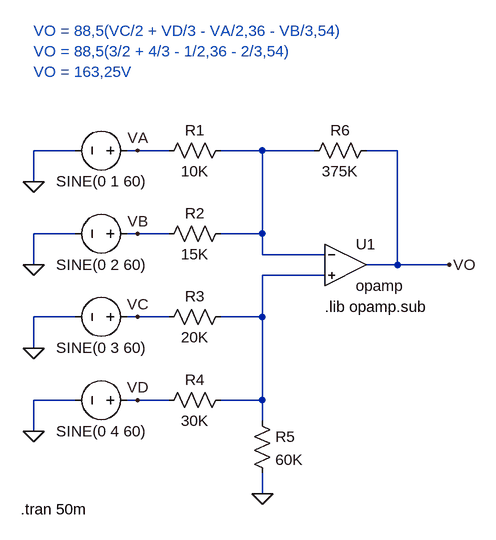
[diagram p0: schematic AMP10 - Amplificadores Ideais - Exercicio III.asc]
AMP10 - Amplificadores Ideais - Exercicio III.asc, the LTspice schematic file:
Version 4
SHEET 1 880 680
WIRE -224 -16 -288 -16
WIRE -128 -16 -144 -16
WIRE -80 -16 -128 -16
WIRE 64 -16 0 -16
WIRE 144 -16 64 -16
WIRE 272 -16 224 -16
WIRE -288 32 -288 -16
WIRE -224 112 -288 112
WIRE -128 112 -144 112
WIRE -80 112 -128 112
WIRE 64 112 64 -16
WIRE 64 112 0 112
WIRE 64 144 64 112
WIRE 160 144 64 144
WIRE -288 160 -288 112
WIRE 272 160 272 -16
WIRE 272 160 224 160
WIRE 352 160 272 160
WIRE 160 176 64 176
WIRE -224 240 -288 240
WIRE -128 240 -144 240
WIRE -80 240 -128 240
WIRE 64 240 64 176
WIRE 64 240 0 240
WIRE -288 288 -288 240
WIRE -224 368 -288 368
WIRE -128 368 -144 368
WIRE -80 368 -128 368
WIRE 64 368 64 240
WIRE 64 368 0 368
WIRE 64 400 64 368
WIRE -288 416 -288 368
WIRE 64 512 64 480
FLAG -288 32 0
FLAG -288 160 0
FLAG -288 288 0
FLAG -288 416 0
FLAG -128 -16 VA
FLAG -128 112 VB
FLAG -128 240 VC
FLAG -128 368 VD
FLAG 64 512 0
FLAG 352 160 VO
SYMBOL Opamps\\opamp 192 96 R0
SYMATTR InstName U1
SYMBOL voltage -128 -16 R90
WINDOW 0 -32 56 Invisible 2
WINDOW 3 32 56 VTop 2
WINDOW 123 0 0 Left 2
WINDOW 39 0 0 Left 2
SYMATTR InstName V1
SYMATTR Value SINE(0 1 60)
SYMBOL voltage -128 112 R90
WINDOW 0 -32 56 Invisible 2
WINDOW 3 32 56 VTop 2
WINDOW 123 0 0 Left 2
WINDOW 39 0 0 Left 2
SYMATTR InstName V2
SYMATTR Value SINE(0 2 60)
SYMBOL voltage -128 240 R90
WINDOW 0 -32 56 Invisible 2
WINDOW 3 32 56 VTop 2
WINDOW 123 0 0 Left 2
WINDOW 39 0 0 Left 2
SYMATTR InstName V3
SYMATTR Value SINE(0 3 60)
SYMBOL voltage -128 368 R90
WINDOW 0 -32 56 Invisible 2
WINDOW 3 32 56 VTop 2
WINDOW 123 0 0 Left 2
WINDOW 39 0 0 Left 2
SYMATTR InstName V4
SYMATTR Value SINE(0 4 60)
SYMBOL res 16 -32 R90
WINDOW 0 0 56 VBottom 2
WINDOW 3 32 56 VTop 2
SYMATTR InstName R1
SYMATTR Value 10K
SYMBOL res 16 96 R90
WINDOW 0 0 56 VBottom 2
WINDOW 3 32 56 VTop 2
SYMATTR InstName R2
SYMATTR Value 15K
SYMBOL res 16 224 R90
WINDOW 0 0 56 VBottom 2
WINDOW 3 32 56 VTop 2
SYMATTR InstName R3
SYMATTR Value 20K
SYMBOL res 16 352 R90
WINDOW 0 0 56 VBottom 2
WINDOW 3 32 56 VTop 2
SYMATTR InstName R4
SYMATTR Value 30K
SYMBOL res 48 384 R0
SYMATTR InstName R5
SYMATTR Value 60K
SYMBOL res 240 -32 R90
WINDOW 0 0 56 VBottom 2
WINDOW 3 32 56 VTop 2
SYMATTR InstName R6
SYMATTR Value 375K
TEXT -288 -200 Left 2 ;VO = 88,5(VC/2 + VD/3 - VA/2,36 - VB/3,54)\nVO = 88,5(3/2 + 4/3 - 1/2,36 - 2/3,54)\nVO = 163,25V
TEXT -308 536 Left 2 !.tran 50m
TEXT 160 224 Left 2 !.lib opamp.sub

The netlist it stands for:
* AMP10 - Amplificadores Ideais - Exercicio III.asc
XU1 N001 N002 VO opamp Aol=100K GBW=10Meg  ; pins invin noninvin out
V1 VA 0 SINE(0 1 60)
V2 VB 0 SINE(0 2 60)
V3 VC 0 SINE(0 3 60)
V4 VD 0 SINE(0 4 60)
R1 N001 VA 10K
R2 N001 VB 15K
R3 N002 VC 20K
R4 N002 VD 30K
R5 N002 0 60K
R6 VO N001 375K
* VO = 88,5(VC/2 + VD/3 - VA/2,36 - VB/3,54)
* VO = 88,5(3/2 + 4/3 - 1/2,36 - 2/3,54)
* VO = 163,25V
.tran 50m
.lib opamp.sub
.backanno
.end